# Altium schematic sheet Sheet1.SchDoc
size A0; SheetNumber: 1; SheetTotal: 1
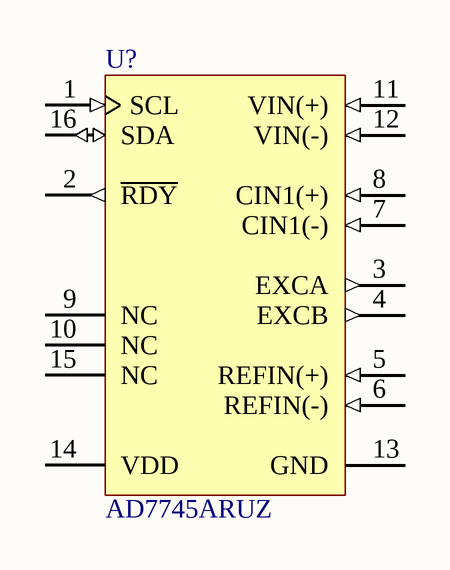
[diagram p0: Sheet1.SchDoc]

## Parts
U?  AD7745ARUZ  [RU-16_M]

## Nets

Not connected (* = marked no-connect by the designer): U? 1(SCL) 2(~{RDY}) 3(EXCA) 4(EXCB) 5(REFIN(+)) 6(REFIN(-)) 7(CIN1(-)) 8(CIN1(+)) 9(NC) 10(NC) 11(VIN(+)) 12(VIN(-)) 13(GND) 14(VDD) 15(NC) 16(SDA)

## Library data of the parts
U? = CMP-0313-01743-2: Single 24-Bit Capacitance-to-Digital Converter with I2C/Ser 2-Wire, Serial Interface and Temperature Sensor, 90SPS, -40 to +125 degC, RU-16, Pb-Free, Tube; Manufacturer: Analog Devices; Generic Part Number: AD7745; Resolution (Bits): 24; Throughput Rate (SPS): 90; Channels: 1; Interface: I2C/Ser 2-Wire, Ser; ComponentLink3URL: http://www.analog.com/static/imported-files/packages/36244347913743854010197452789RU16.pdf; DatasheetVersion: Rev.0; Code_JEDEC: MO-153-AB; Mounting Technology: Surface Mount; PackageReference: RU-16; PartNumber: AD7745ARUZ; ComponentLink4Description: Product URL; ComponentLink2Description: Datasheet; ComponentLink3Description: Package Specification; ComponentLink4URL: http://www.analog.com/en/analog-to-digital-converters/ad-converters/ad7745/products/product.html; ComponentLink1URL: http://www.analog.com/en/index.html; ComponentLink2URL: http://www.analog.com/static/imported-files/data_sheets/AD7745_7746.pdf; ComponentLink1Description: Manufacturer URL; RoHS: Y; Packing: Tube; PackageDescription: 16-Lead Thin Shrink Small Outline Package [TSSOP]; PackageVersion: Nov-2002